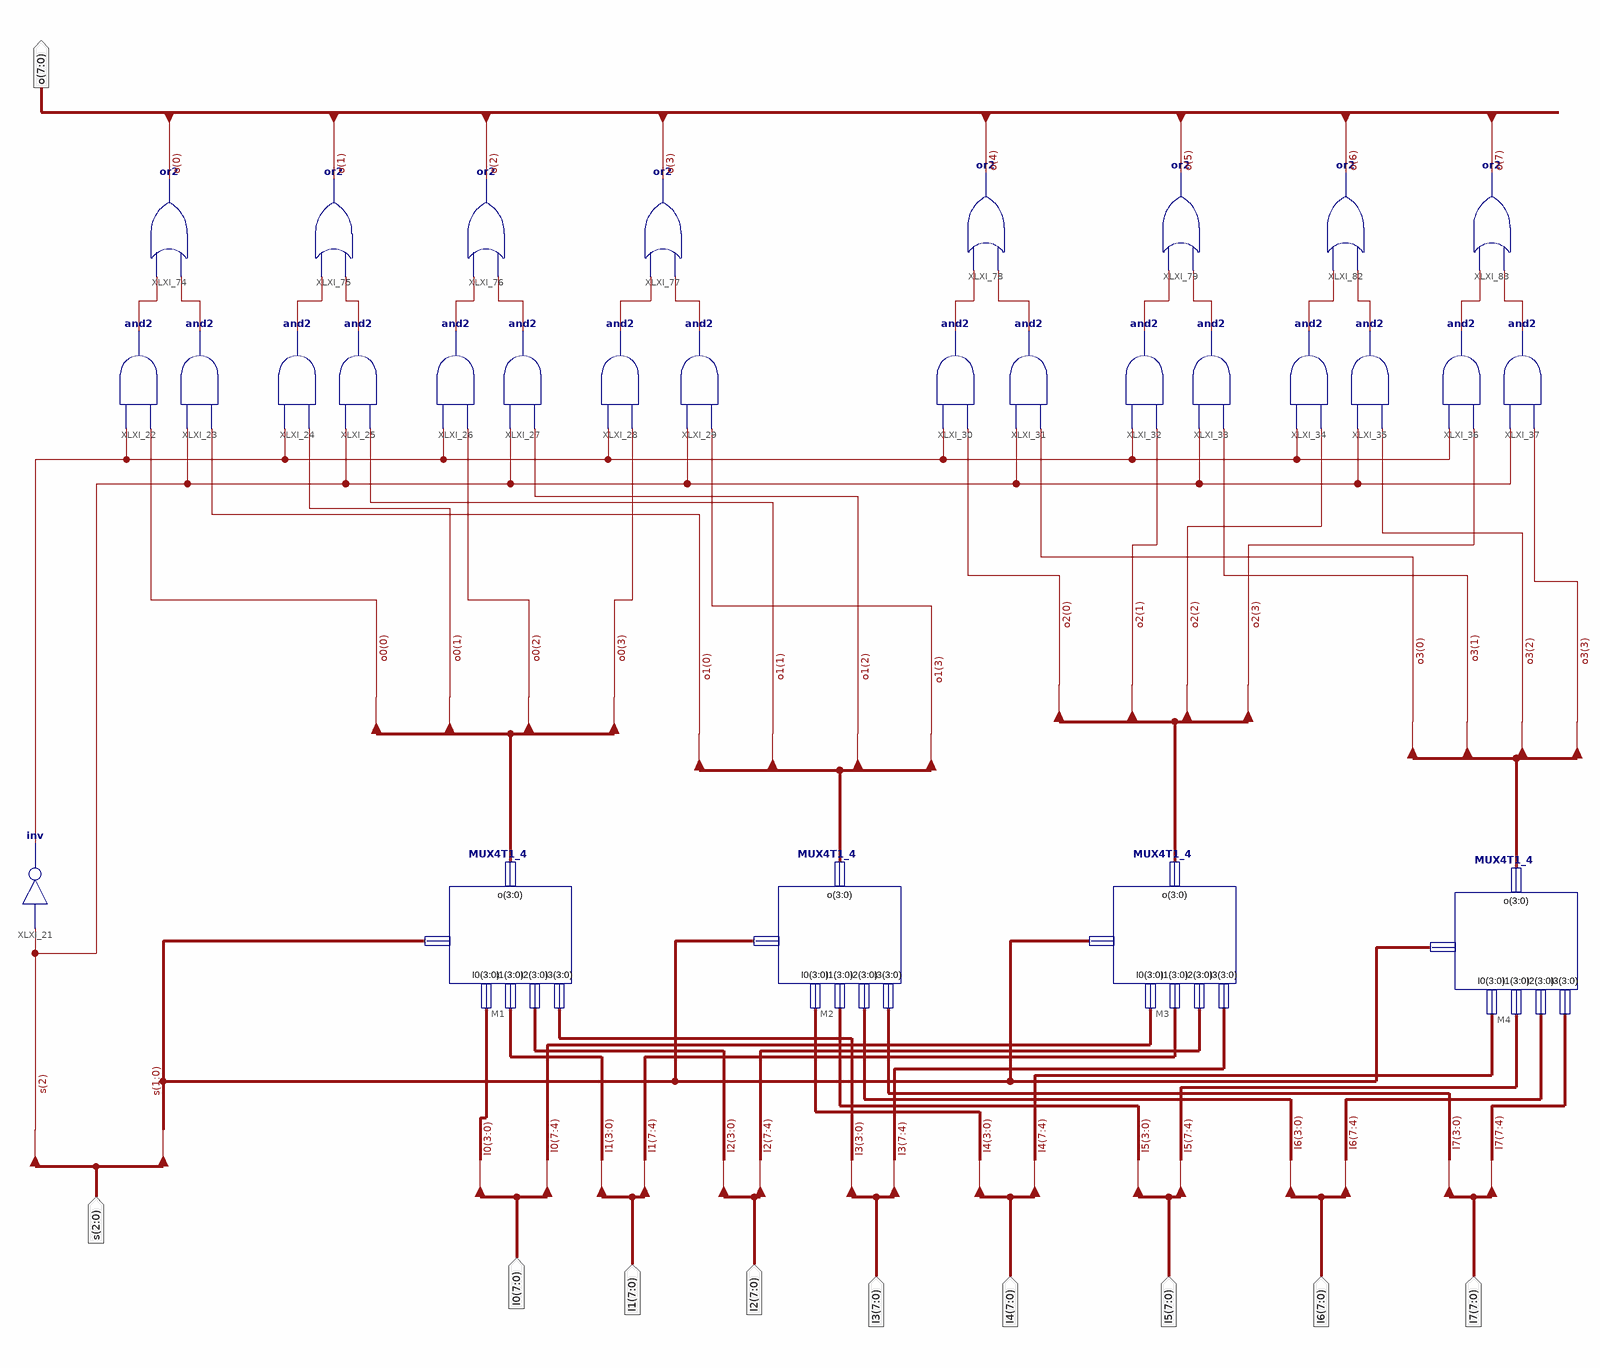
[diagram p0: schematic sheet 1]
// Xilinx ISE schematic MUX8T1_8.sch (kintex7) as structural Verilog: 29 symbols, 10 ports
module MUX8T1_8 (
  input  [7:0] I0,
  input  [7:0] I1,
  input  [7:0] I2,
  input  [7:0] I3,
  input  [7:0] I4,
  input  [7:0] I5,
  input  [7:0] I6,
  input  [7:0] I7,
  input  [2:0] s,
  output [7:0] o
);

  wire XLXN_90, XLXN_106, XLXN_107, XLXN_108, XLXN_109, XLXN_110, XLXN_111, XLXN_112, XLXN_113, XLXN_114,
       XLXN_115, XLXN_116, XLXN_117, XLXN_118, XLXN_119, XLXN_120, XLXN_121;
  wire [3:0] o0, o1, o2, o3;

  not XLXI_21 (XLXN_90, s[2]);
  and XLXI_30 (XLXN_114, o2[0], XLXN_90);
  and XLXI_31 (XLXN_115, o3[0], s[2]);
  and XLXI_32 (XLXN_116, o2[1], XLXN_90);
  and XLXI_33 (XLXN_117, o3[1], s[2]);
  and XLXI_34 (XLXN_118, o2[2], XLXN_90);
  and XLXI_35 (XLXN_119, o3[2], s[2]);
  and XLXI_36 (XLXN_120, o2[3], XLXN_90);
  and XLXI_37 (XLXN_121, o3[3], s[2]);
  and XLXI_28 (XLXN_112, o0[3], XLXN_90);
  and XLXI_29 (XLXN_113, o1[3], s[2]);
  and XLXI_26 (XLXN_110, o0[2], XLXN_90);
  and XLXI_27 (XLXN_111, o1[2], s[2]);
  and XLXI_24 (XLXN_108, o0[1], XLXN_90);
  and XLXI_25 (XLXN_109, o1[1], s[2]);
  and XLXI_22 (XLXN_106, o0[0], XLXN_90);
  and XLXI_23 (XLXN_107, o1[0], s[2]);
  or XLXI_74 (o[0], XLXN_107, XLXN_106);
  or XLXI_75 (o[1], XLXN_109, XLXN_108);
  or XLXI_76 (o[2], XLXN_111, XLXN_110);
  or XLXI_77 (o[3], XLXN_113, XLXN_112);
  or XLXI_78 (o[4], XLXN_115, XLXN_114);
  or XLXI_79 (o[5], XLXN_117, XLXN_116);
  or XLXI_82 (o[6], XLXN_119, XLXN_118);
  or XLXI_83 (o[7], XLXN_121, XLXN_120);
  MUX4T1_4 M1 (.I0(I0[3:0]), .I1(I1[3:0]), .I2(I2[3:0]), .I3(I3[3:0]), .s(s[1:0]), .o(o0));
  MUX4T1_4 M2 (.I0(I4[3:0]), .I1(I5[3:0]), .I2(I6[3:0]), .I3(I7[3:0]), .s(s[1:0]), .o(o1));
  MUX4T1_4 M3 (.I0(I0[7:4]), .I1(I1[7:4]), .I2(I2[7:4]), .I3(I3[7:4]), .s(s[1:0]), .o(o2));
  MUX4T1_4 M4 (.I0(I4[7:4]), .I1(I5[7:4]), .I2(I6[7:4]), .I3(I7[7:4]), .s(s[1:0]), .o(o3));
endmodule
